# EasyEDA Pro project Signal-blocker_2025-02-25.epro

# Schematic Schematic1

## Sheets
1 Power Supply: Board Name: Board1; Create Date: 2025-02-22; Page Name: Power Supply; Project Name: 振荡器; Schematic Name: Schematic1; Update Date: 2025-02-24; Company: 嘉立创EDA; Page Size: A4; Version: V1.0
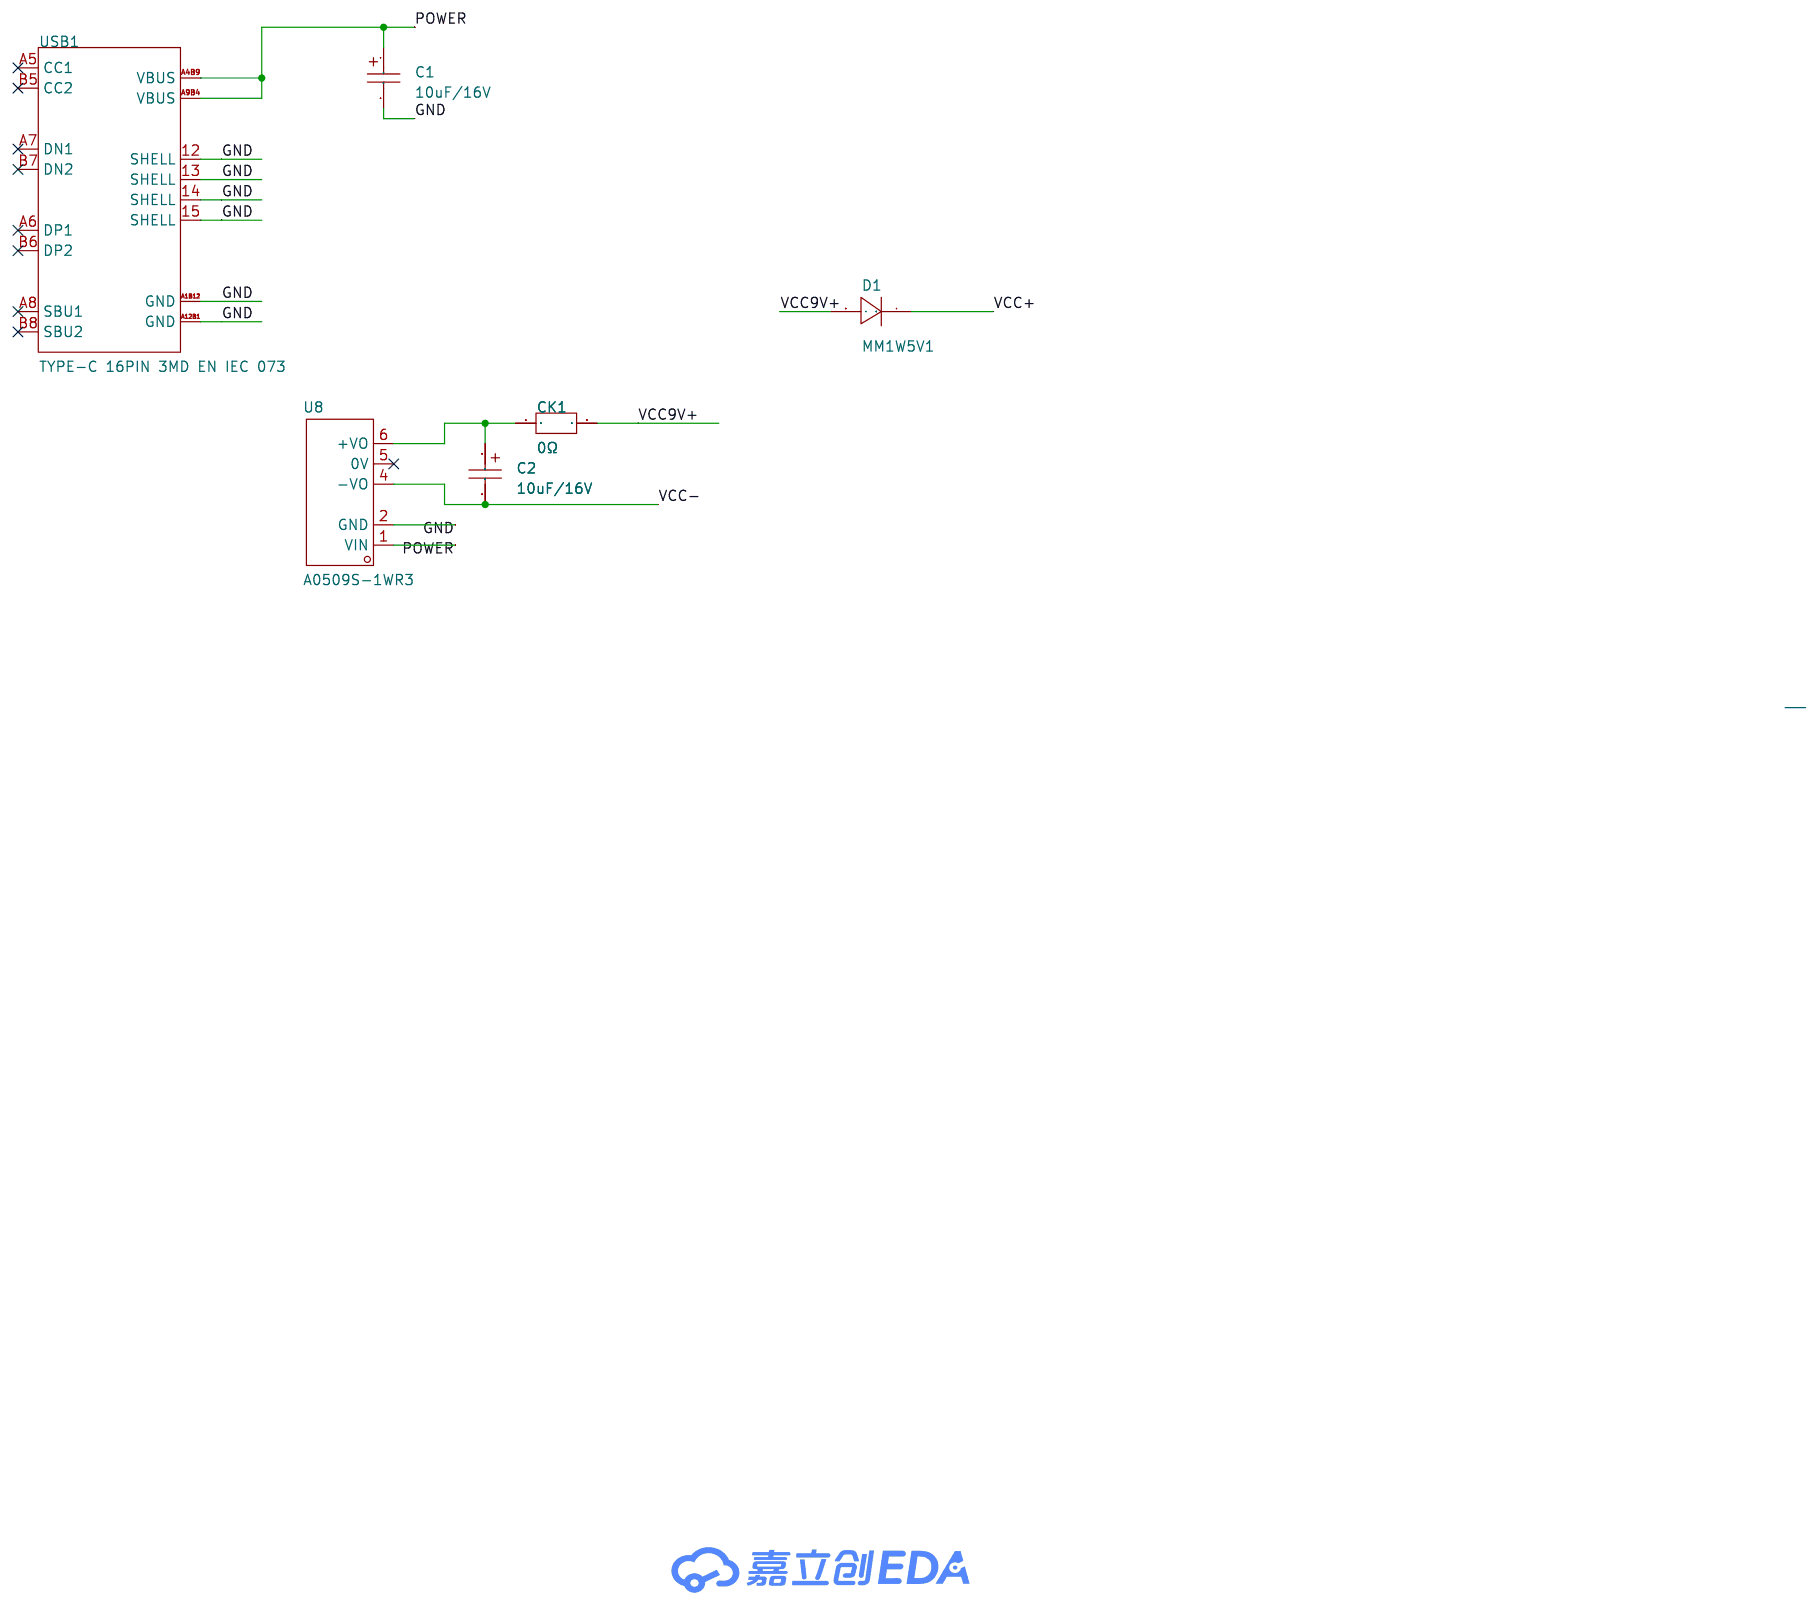
[diagram p0: Power Supply]
2 VCO Module: Create Date: 2025-02-24; Page Name: VCO Module
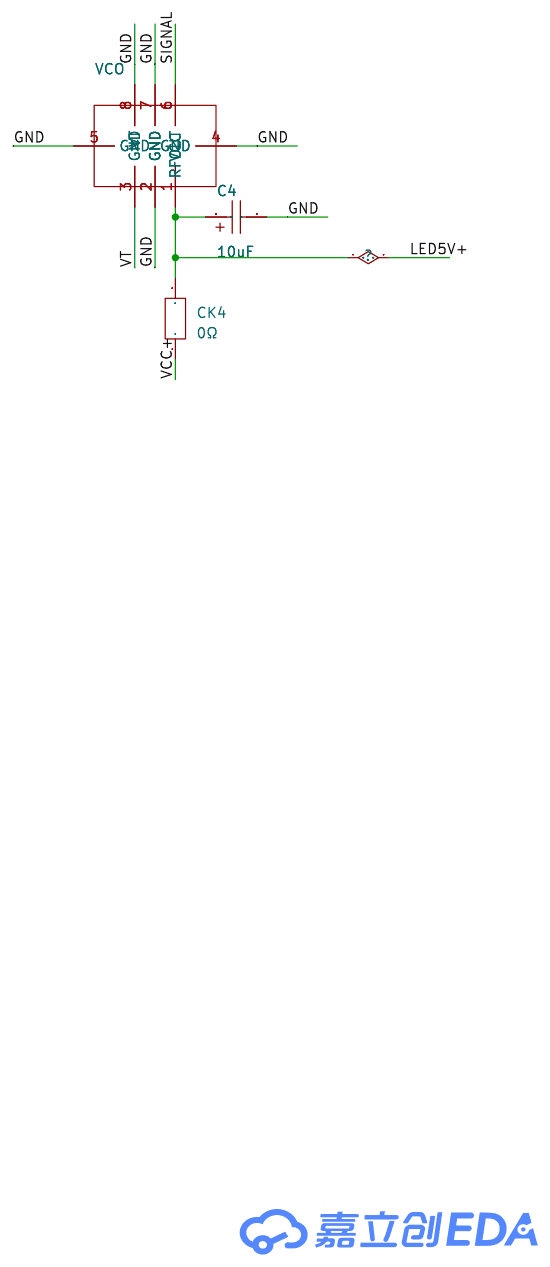
[diagram p1: VCO Module]
3 RFID Module: Create Date: 2025-02-24; Page Name: RFID Module
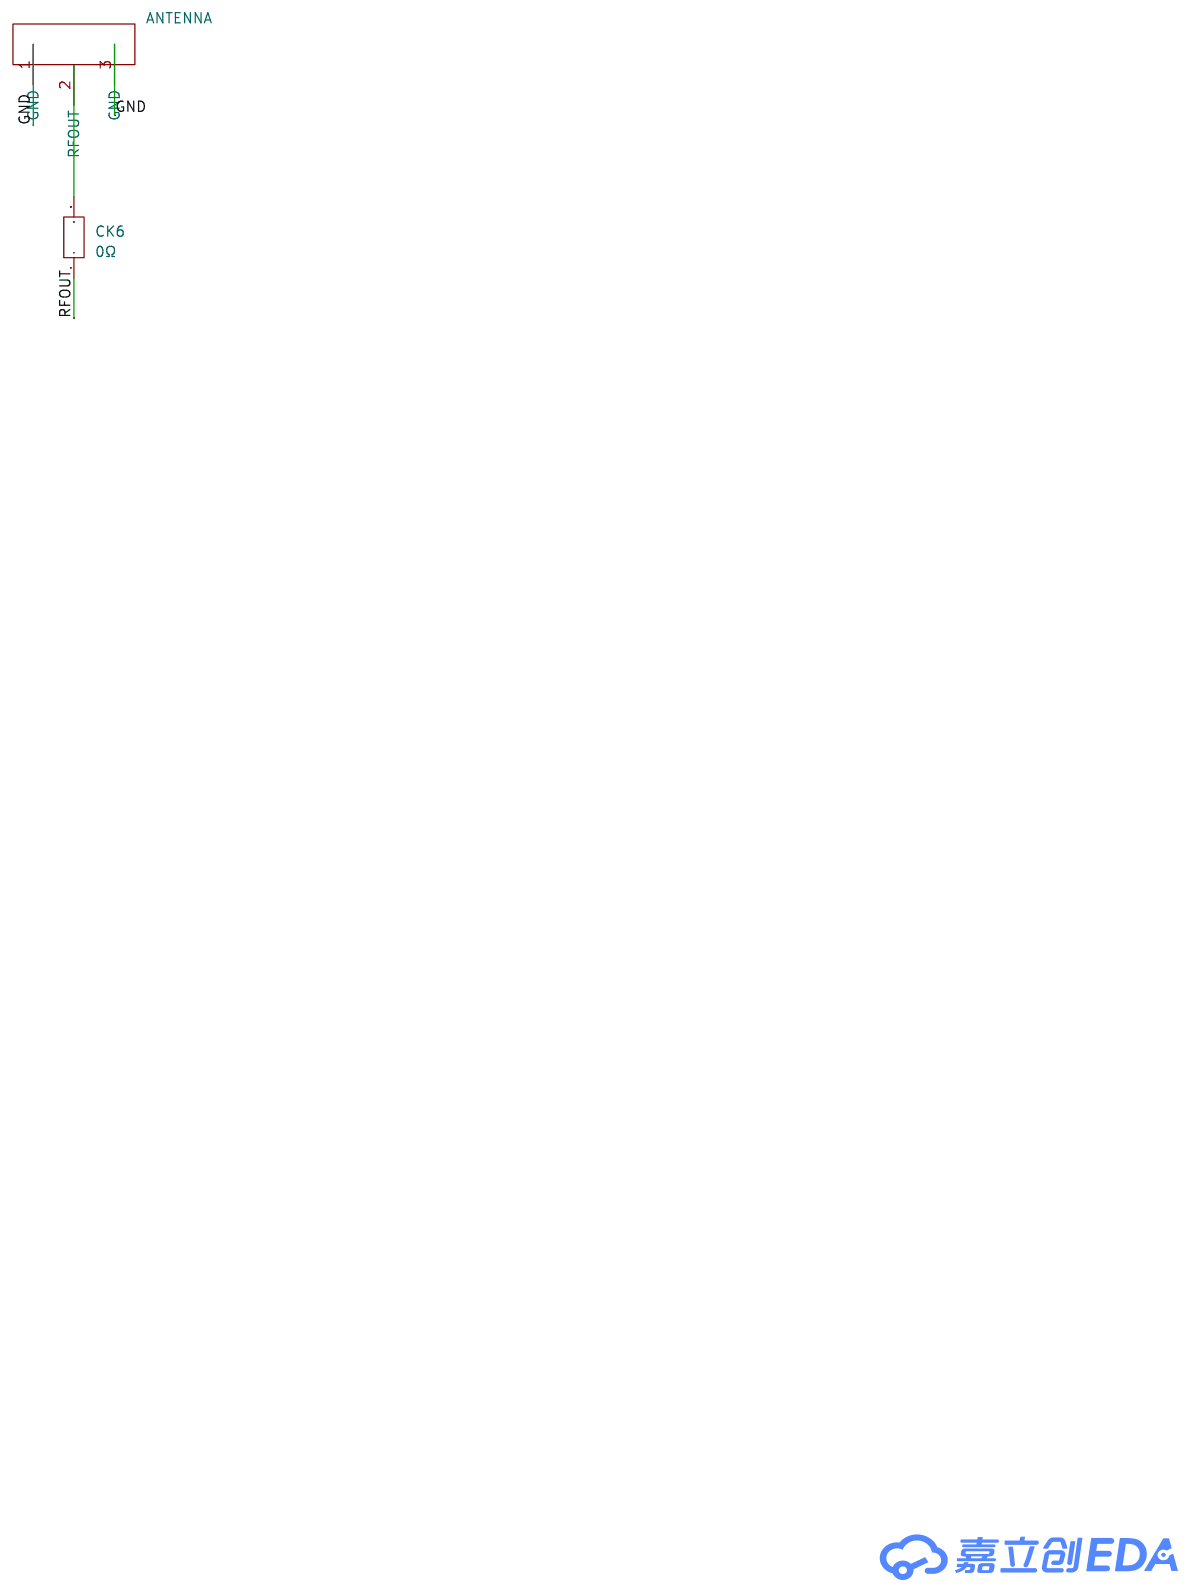
[diagram p2: RFID Module]
4 Voltage-adjust Module: Create Date: 2025-02-24; Page Name: Voltage-adjust Module
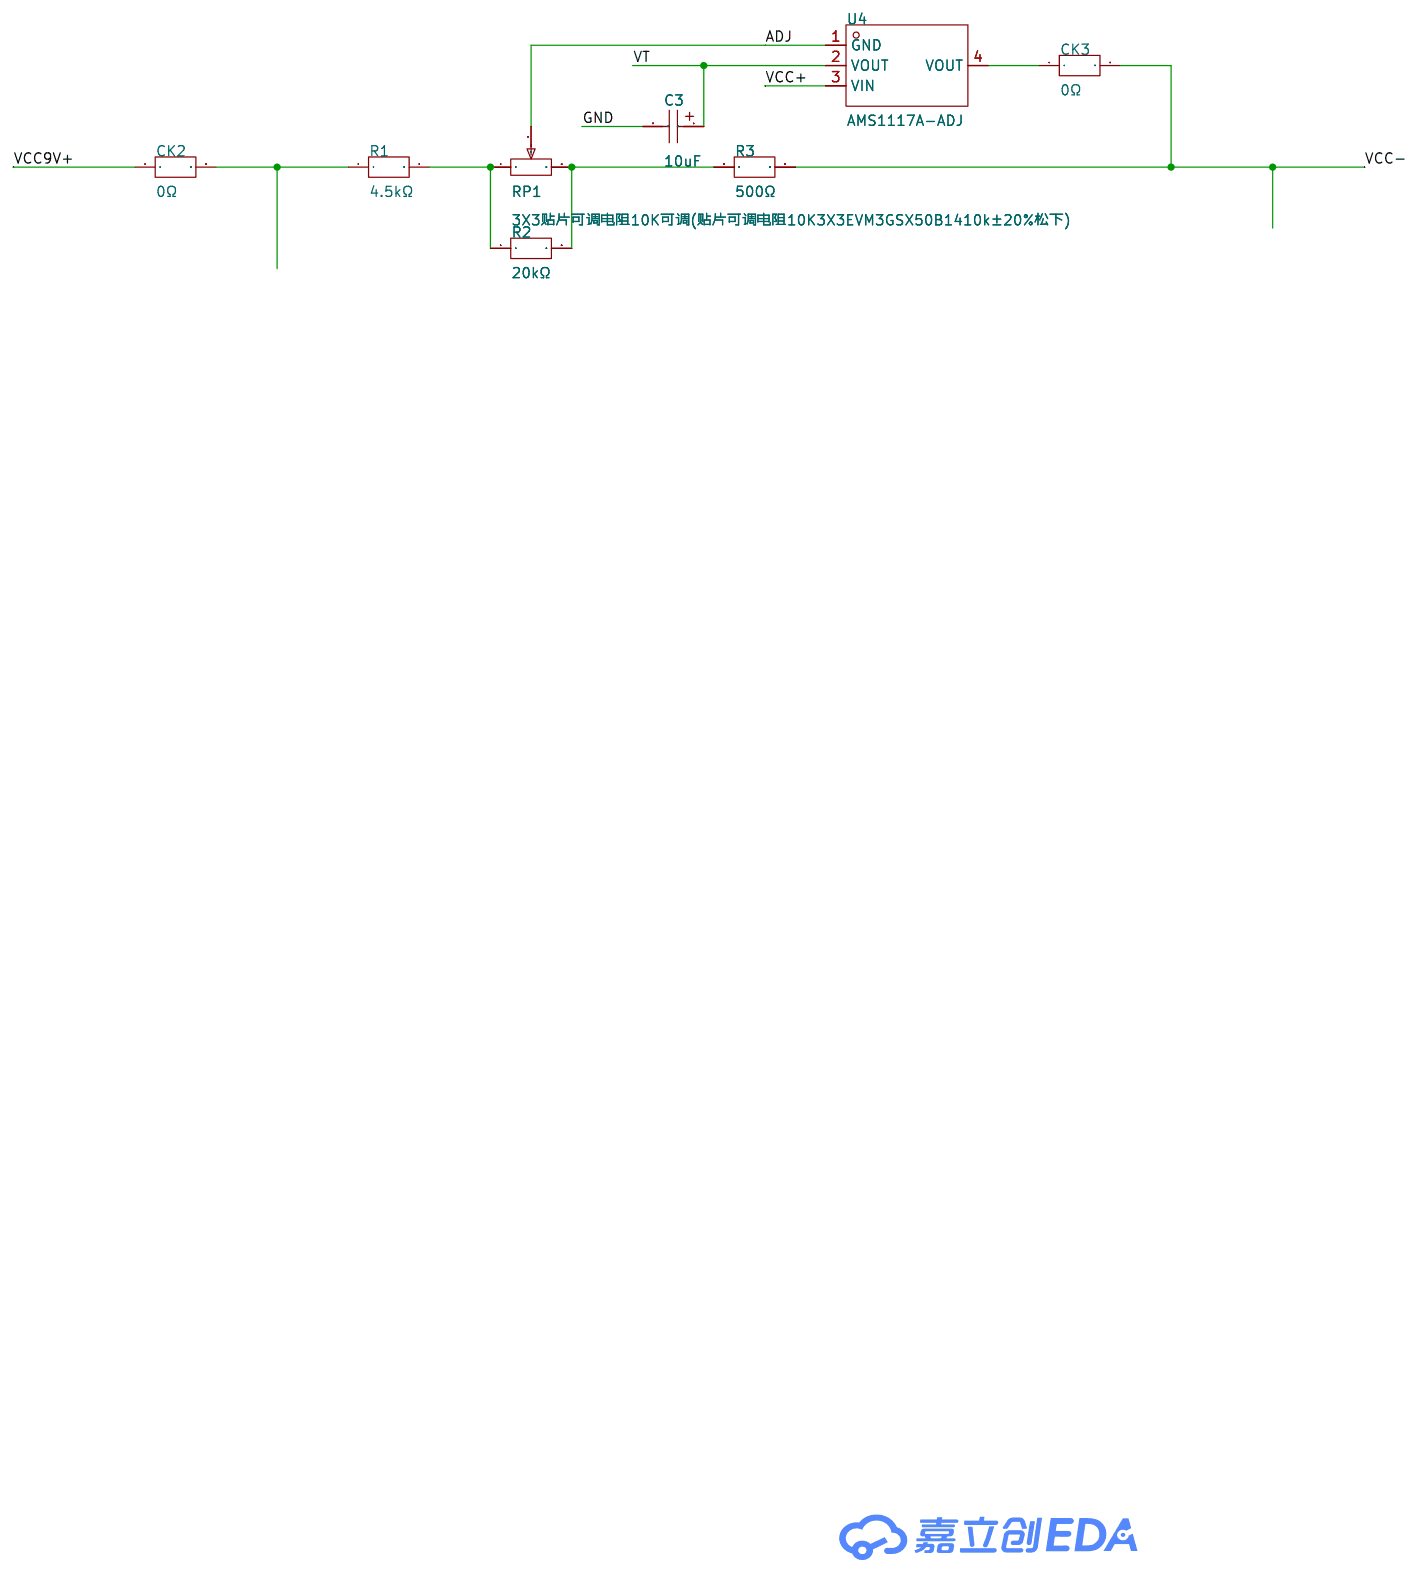
[diagram p3: Voltage-adjust Module]
5 Check Circuit: Create Date: 2025-02-24; Page Name: Check Circuit
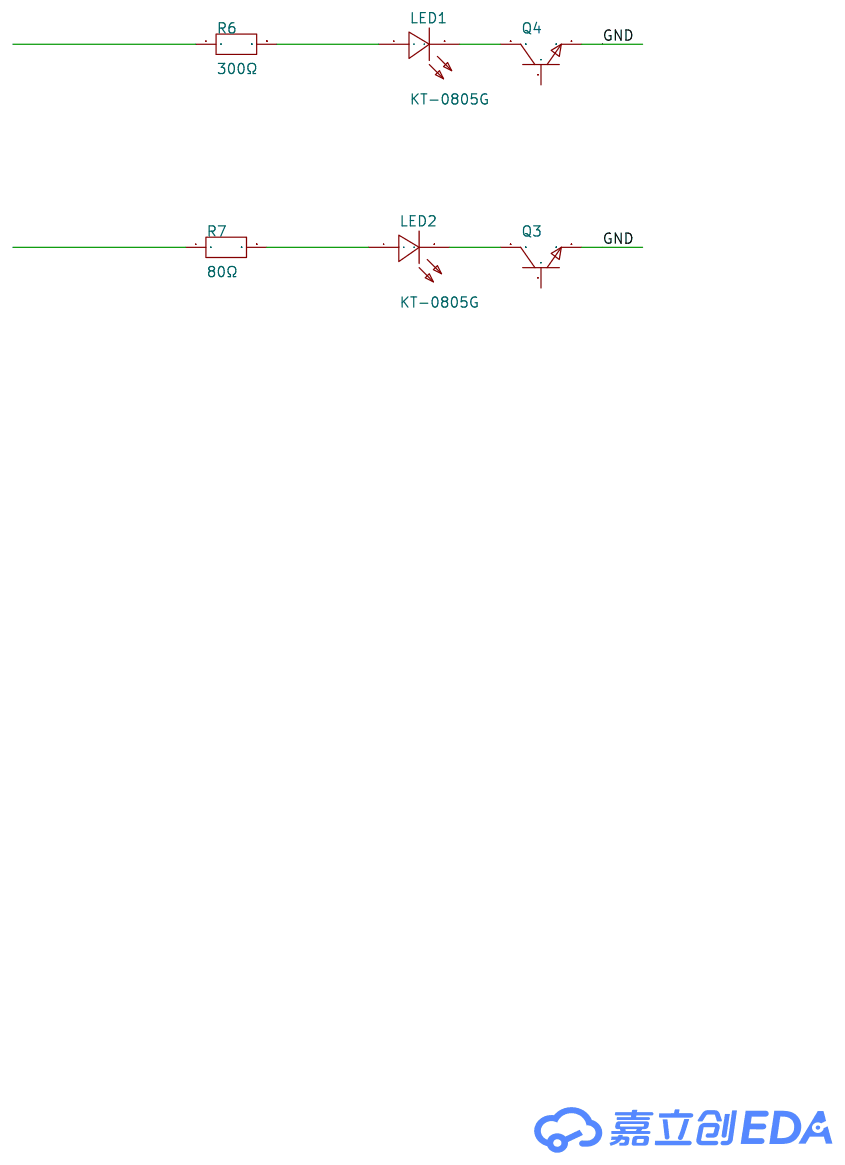
[diagram p4: Check Circuit]
6 Noise-remove Module: Create Date: 2025-02-24; Page Name: Noise-remove Module
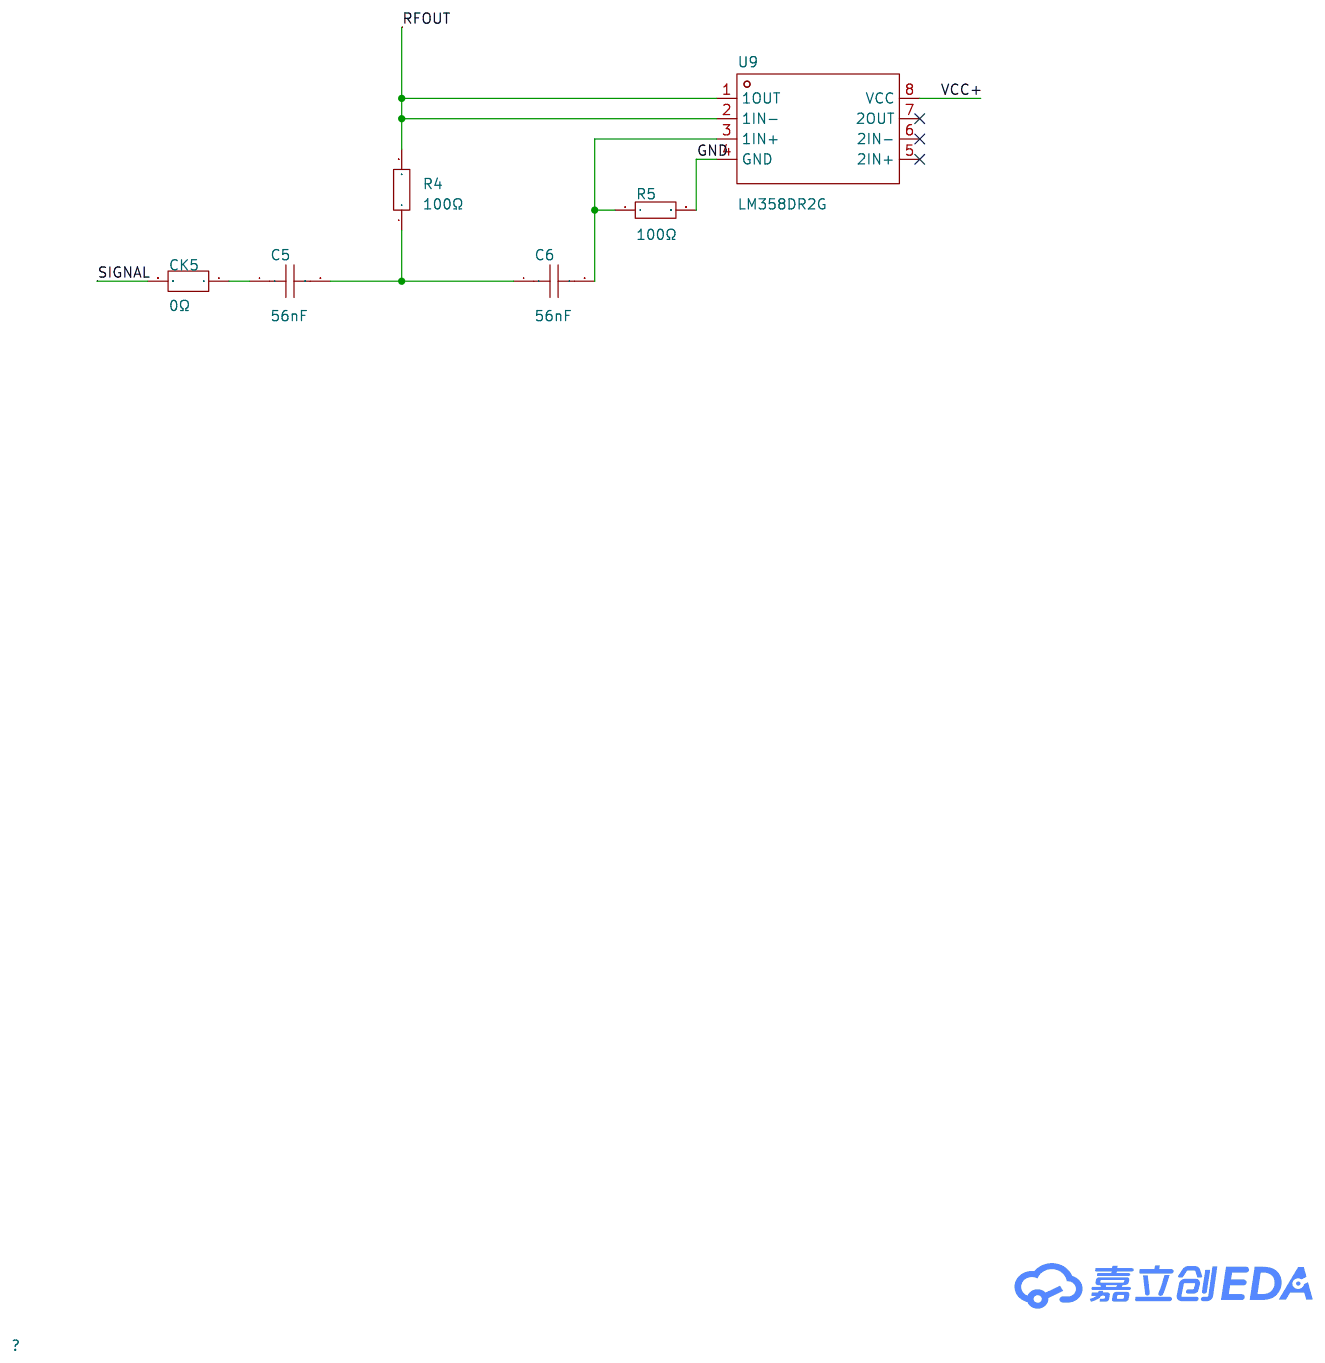
[diagram p5: Noise-remove Module]
7 Signal-enhance Module: Create Date: 2025-02-24
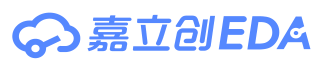
[diagram p6: Signal-enhance Module]

## Parts
sheet Check Circuit
LED1  KT-0805G  [LED0805-R-RD]
LED2  KT-0805G  [LED0805-R-RD]
Q3  -  [S8050_SOT-23]
Q4  -  [S8050_SOT-23]
R6  300Ω  [R2010]
R7  80Ω  [R2010]
sheet Noise-remove Module
C5  56nF  [C0402]
C6  56nF  [C0402]
CK5  0Ω  [R0603]
R4  100Ω  [R0805]
R5  100Ω  [R0805]
U9  LM358DR2G  [SOIC-8_L5.0-W4.0-P1.27-LS6.0-BL]
sheet Power Supply
C1  10uF/16V  [CAP-SMD_L3.2-W1.6-RD-C7171]
C2  10uF/16V  [CAP-SMD_L3.2-W1.6-RD-C7171]
CK1  0Ω  [R0603]
D1  MM1W5V1  [SOD-123_L2.7-W1.6-LS3.7-RD]
U8  A0509S-1WR3  [PWRM-TH_A05XXS-1WR3]
USB1  TYPE-C 16PIN 3MD EN IEC 073  [TYPE-C-SMD_HDGC_TYPE-C-ZL-104PWB]
sheet RFID Module
ANTENNA  -  [wire]
CK6  0Ω  [R0603]
sheet VCO Module
C4  10uF  [CAP-SMD_L3.2-W1.6-RD-C7171]
CK4  0Ω  [R0603]
VCO  -  [1234]
sheet Voltage-adjust Module
C3  10uF  [CAP-SMD_L3.2-W1.6-RD-C7171]
CK2  0Ω  [R0603]
CK3  0Ω  [R0603]
R1  4.5kΩ  [R0805]
R2  20kΩ  [R0805]
R3  500Ω  [R0805]
RP1  3X3贴片可调电阻10K可调(贴片可调电阻10K3X3EVM3GSX50B1410k±20%松下)  [RES-ADJ-SMD_3P-L3.0-W3.8-P1.75-BR]
U4  AMS1117A-ADJ  [SOT-223_L6.3-W3.5-P2.30-LS7.0-BR]

## Library data of the parts
LED1 LED2 = KT-0805G: 灯头类型:-;发光颜色:翠绿色;正向电压(VF):-;功率:-;正向电流:-;主波长:-;二极管配置:-;透镜颜色:-;色温:-;发光强度:-;发光角度:-;载带方式:-;工作温度:-;; LCSC Part Name: 0805 翠绿 高亮; Supplier Part: C2297; Manufacturer: KENTO; Supplier Footprint: 0805; JLCPCB Part Class: 基础库; Datasheet: https://atta.szlcsc.com/upload/public/pdf/source/20170209/1486607340485.pdf; Supplier: LCSC; Emitted Color: 翠绿色
Q3 Q4 = S8050_SOT_NPN: Supplier Footprint: SOT-23
R6 R7 = RS-10K3001FT: 电阻类型:厚膜电阻;阻值:3kΩ;精度:±1%;功率:750mW;温度系数:±100ppm/℃;; LCSC Part Name: 厚膜电阻 3kΩ ±1% 750mW; Supplier Part: C880255; Manufacturer: FH(风华); Supplier Footprint: 2010; JLCPCB Part Class: 扩展库; Datasheet: https://atta.szlcsc.com/upload/public/pdf/source/20140616/1457707091974.pdf; Supplier: LCSC; Type: 厚膜电阻; Tolerance: ±1%; Power(Watts): 750mW; Temperature Coefficient: ±100ppm/℃
C5 C6 = 0402B563K160CT: 容值:56nF;精度:±10%;额定电压:16V;材质(温度系数):X7R;; LCSC Part Name: 56nF ±10% 16V; Supplier Part: C555392; Manufacturer: Walsin(华新科); Supplier Footprint: 0402; JLCPCB Part Class: 扩展库; Datasheet: https://atta.szlcsc.com/upload/public/pdf/source/20191217/C469650_84AD5C6F618CF4AC0C6D987F2E8FE6F8.pdf; Supplier: LCSC; Tolerance: ±10%; Voltage Rated: 16V; Temperature Coefficient: X7R
CK1-CK6 = 0Ω: Supplier Part: C9900083234; Supplier Footprint: 0603; JLCPCB Part Class: 扩展库; Supplier: LCSC
R4 R5 = 0805W8F1000T5E: 电阻类型:厚膜电阻;阻值:100Ω;精度:±1%;功率:125mW;最大工作电压:150V;温度系数:±100ppm/℃;; LCSC Part Name: 100Ω ±1% 125mW 厚膜电阻; Supplier Part: C17408; Manufacturer: UNI-ROYAL(厚声); Supplier Footprint: 0805; JLCPCB Part Class: 基础库; Datasheet: https://atta.szlcsc.com/upload/public/pdf/source/20200306/C422600_1E6D84923E4A46A82E41ADD87F860B5C.pdf; Supplier: LCSC; Type: 厚膜电阻; Tolerance: ±1%; Power(Watts): 125mW; Overload Voltage (Max): 150V; Temperature Coefficient: ±100ppm/℃; Operating Temperature Range: -55℃~+155℃
U9 = LM358DR2G: 放大器数:双路;轨到轨:-;增益带宽积(GBP):1MHz;输入失调电压(Vos):7mV;压摆率(SR):-;输入偏置电流(Ib):45nA;; Supplier Part: C7950; Manufacturer: onsemi(安森美); Supplier Footprint: SOIC-8; JLCPCB Part Class: 基础库; Datasheet: https://atta.szlcsc.com/upload/public/pdf/source/20150124/1457707258826.pdf; Supplier: LCSC; Number of Circuits: 双路; Maximum Power Supply Range (Vdd-Vss): 32V; Gain Bandwidth Product(GBP): 1MHz; Voltage - Input Offset(Vos): 7mV; Input Offset Voltage Drift (Vos TC): 7uV/℃; Current - Input Bias(Ib): 45nA; Common Mode Rejection Ratio (CMRR): 70dB; Quiescent Current: 1.5mA; Output Current: 40mA; Operating Temperature: 0℃~+70℃
C1-C4 = TAJA106K016RNJ: 容值:10uF;精度:±10%;额定电压:16V;等效串联电阻:3Ω@100kHz;; LCSC Part Name: 10uF ±10% 16V; Supplier Part: C7171; Manufacturer: Kyocera AVX; Supplier Footprint: CASE-A-3216; JLCPCB Part Class: 基础库; Datasheet: https://atta.szlcsc.com/upload/public/pdf/source/20160107/1457707750344.pdf; Supplier: LCSC; Tolerance: ±10%; Rated Voltage: 16V; Equivalent Series Resistance(ESR): 3Ω@100kHz; Operating Temperature: -55℃~+125℃
D1 = MM1W5V1: 二极管配置:独立式;稳压值(标称值):5.1V;稳压值(范围):4.84V~5.36V;功率(Pd):1W;; LCSC Part Name: 齐纳二极管 5.1V 1W; Supplier Part: C382836; Manufacturer: 晶导微电子; Supplier Footprint: SOD-123; JLCPCB Part Class: 扩展库; Datasheet: https://atta.szlcsc.com/upload/public/pdf/source/20190618/C382951_749579DA53C45F90F6E07B432E1D8FD6.pdf; Supplier: LCSC; Diode Configuration: 独立式; Zener Voltage (Nom): 5.1V; Reverse Leakage Current (Ir): 10uA@1V; Zener Voltage (Range): 4.84V~5.36V; Power Dissipation: 1W; Zener Impedance (Zzt): 7Ω
U8 = A0509S-1WR3_C5369385: A0509S-1WR3 ---是小体积，高效率的微小功率，定电压输入，隔离非稳压正负双路输出，DC/DC 模块电源；该产品是专门针对板上电源系统中需要产生一组与输入电源隔离的电压的应用场合而设计的。该产品适用于：●输入电源的电压比较稳定（电压变化范围±10%Vin）；●输入输出之间要求隔离（隔离电压≤1500VDC）；●对输出电压稳定度要求不高的场合。；●典型应用：纯数字电路场合，一般低频模拟电路场合，继电器驱动电路，数据交换电路场合等;; Supplier Part: C5369385; Manufacturer: YLPTEC(易川); Supplier Footprint: SIP; JLCPCB Part Class: 扩展库; Datasheet: https://atta.szlcsc.com/upload/public/pdf/source/20230712/CE7059F6A87E500D281D8B0F754C5B41.pdf; Supplier: LCSC; TYPE: 升压型; Number of channel: 2; Power: 1W; input voltage (Vdc): 4.5V~5.5V; Conversion Efficiency: 89%; Output Voltage: ±9V; Output Current (Max): ±56mA；±6mA; Maximum Capacitive Load: 560uF; Insulated Voltage: 1500V; Protective function: 短路保护
USB1 = TYPE-C 16PIN 3MD EN IEC 073: TYPE C 16PIN母座 带弹 5A 符合最新欧盟lEC62680-1-3认证; LCSC Part Name: TYPE-C 母座; Supplier Part: C42434192; Manufacturer: SHOU HAN(首韩); Supplier Footprint: SMD; Datasheet: https://atta.szlcsc.com/upload/public/pdf/source/20250103/7C8E9EC35CBB36C3A211B1F25C96EB7A.pdf; Supplier: LCSC
ANTENNA = wire
VCO = vco
R1 = Y16294K50000B9W: 电阻类型:-;阻值:4.5kΩ;精度:±0.1%;功率:100mW;温度系数:±0.2ppm/℃;; LCSC Part Name: 4.5kΩ ±0.1% 100mW; Supplier Part: C4226006; Manufacturer: VISHAY(威世); Supplier Footprint: 0805; JLCPCB Part Class: 扩展库; Supplier: LCSC; Tolerance: ±0.1%; Power(Watts): 100mW; Temperature Coefficient: ±0.2ppm/℃; Operating Temperature Range: -55℃~+150℃
R2 = RT0805BRD0753R6L: 电阻类型:薄膜电阻;阻值:53.6Ω;精度:±0.1%;功率:125mW;温度系数:±25ppm/℃;; LCSC Part Name: 薄膜电阻 53.6Ω ±0.1% 125mW; Supplier Part: C865552; Manufacturer: YAGEO(国巨); Supplier Footprint: 0805; JLCPCB Part Class: 扩展库; Datasheet: https://atta.szlcsc.com/upload/public/pdf/source/20200610/C326738_5639A9F1B6EB6E4AE2197577D3456E7F.pdf; Supplier: LCSC; Type: 薄膜电阻; Tolerance: ±0.1%; Power(Watts): 125mW; Temperature Coefficient: ±25ppm/℃; Operating Temperature: -55℃~+155℃
R3 = AR05ATB0500: 阻值:50Ω;精度:±0.05%;温度系数:±10ppm/℃;; LCSC Part Name: 50Ω ±0.05%; Supplier Part: C3015189; Manufacturer: Viking(光颉); Supplier Footprint: 0805; JLCPCB Part Class: 扩展库; Datasheet: https://atta.szlcsc.com/upload/public/pdf/source/20191129/C465721_10D49275DB41E427863CE9C8D788770A.pdf; Supplier: LCSC; Tolerance: ±0.05%; Temperature Coefficient: ±10ppm/℃
RP1 = 3X3贴片可调电阻10K可调(贴片可调电阻10K3X3EVM3GSX50B1410k±20%松下): Supplier Part: C9900002171; Supplier Footprint: SMD-3; JLCPCB Part Class: 扩展库; Supplier: LCSC
U4 = AMS1117A-ADJ: Supplier Part: C2984864; Manufacturer: HX(恒佳兴); Supplier Footprint: SOT-223; JLCPCB Part Class: 扩展库; Datasheet: https://atta.szlcsc.com/upload/public/pdf/source/20220408/BD3226BAC8A4B812F5CB2AD559ECEC03.pdf; Supplier: LCSC

## Nets
GND: ANTENNA.1(GND) ANTENNA.3(GND) C1.2 C3.2 C4.2 Q3.2 Q4.2 R5.2 U8.2(GND) U9.4(GND) USB1.12(SHELL) USB1.13(SHELL) USB1.14(SHELL) USB1.15(SHELL) USB1.A1B12(GND) USB1.A12B1(GND) VCO.2(GND) VCO.4(GND) VCO.5(GND) VCO.7(GND) VCO.8(VT)
VCC9V+: CK1.2 CK2.1 D1.2(A)
VCC+: CK4.1 D1.1(C) U4.3(VIN) U9.8(VCC)
VCC-: C2.2 CK3.2 R3.2 U8.4(-VO)
ADJ: RP1.2 U4.1(GND)
LED5V+: C4.1 CK4.2 VCO.1(VCC)
POWER: C1.1 U8.1(VIN) USB1.A4B9(VBUS) USB1.A9B4(VBUS)
RFOUT: CK6.1 R4.2 U9.1(1OUT) U9.2(1IN-)
SIGNAL: CK5.2 VCO.6(RFOUT)
VT: C3.1 U4.2(VOUT) VCO.3(GND)
$3N135: ANTENNA.2(RFOUT) CK6.2
$4N526: R1.2 R2.1 RP1.1
$4N812: CK3.1 U4.4(VOUT)
$6N289: C5.2 C6.1 R4.1
$6N421: C6.2 R5.1 U9.3(1IN+)
Net-(C2-1): C2.1 CK1.1 U8.6(+VO)
Net-(C5-1): C5.1 CK5.1
Net-(CK2-2): CK2.2 R1.1
Net-(LED1-1): LED1.1(A) R6.2
Net-(LED1-2): LED1.2(K) Q4.3
Net-(LED2-1): LED2.1(A) R7.2
Net-(LED2-2): LED2.2(K) Q3.3
Net-(R2-2): R2.2 R3.1 RP1.3

Not connected (* = marked no-connect by the designer): Q3 1; Q4 1; R6 1; R7 1; U8 5(0V)*; U9 5(2IN+)* 6(2IN-)* 7(2OUT)*; USB1 A5(CC1)* A6(DP1)* A7(DN1)* A8(SBU1)* B5(CC2)* B6(DP2)* B7(DN2)* B8(SBU2)*

# Board PCB1
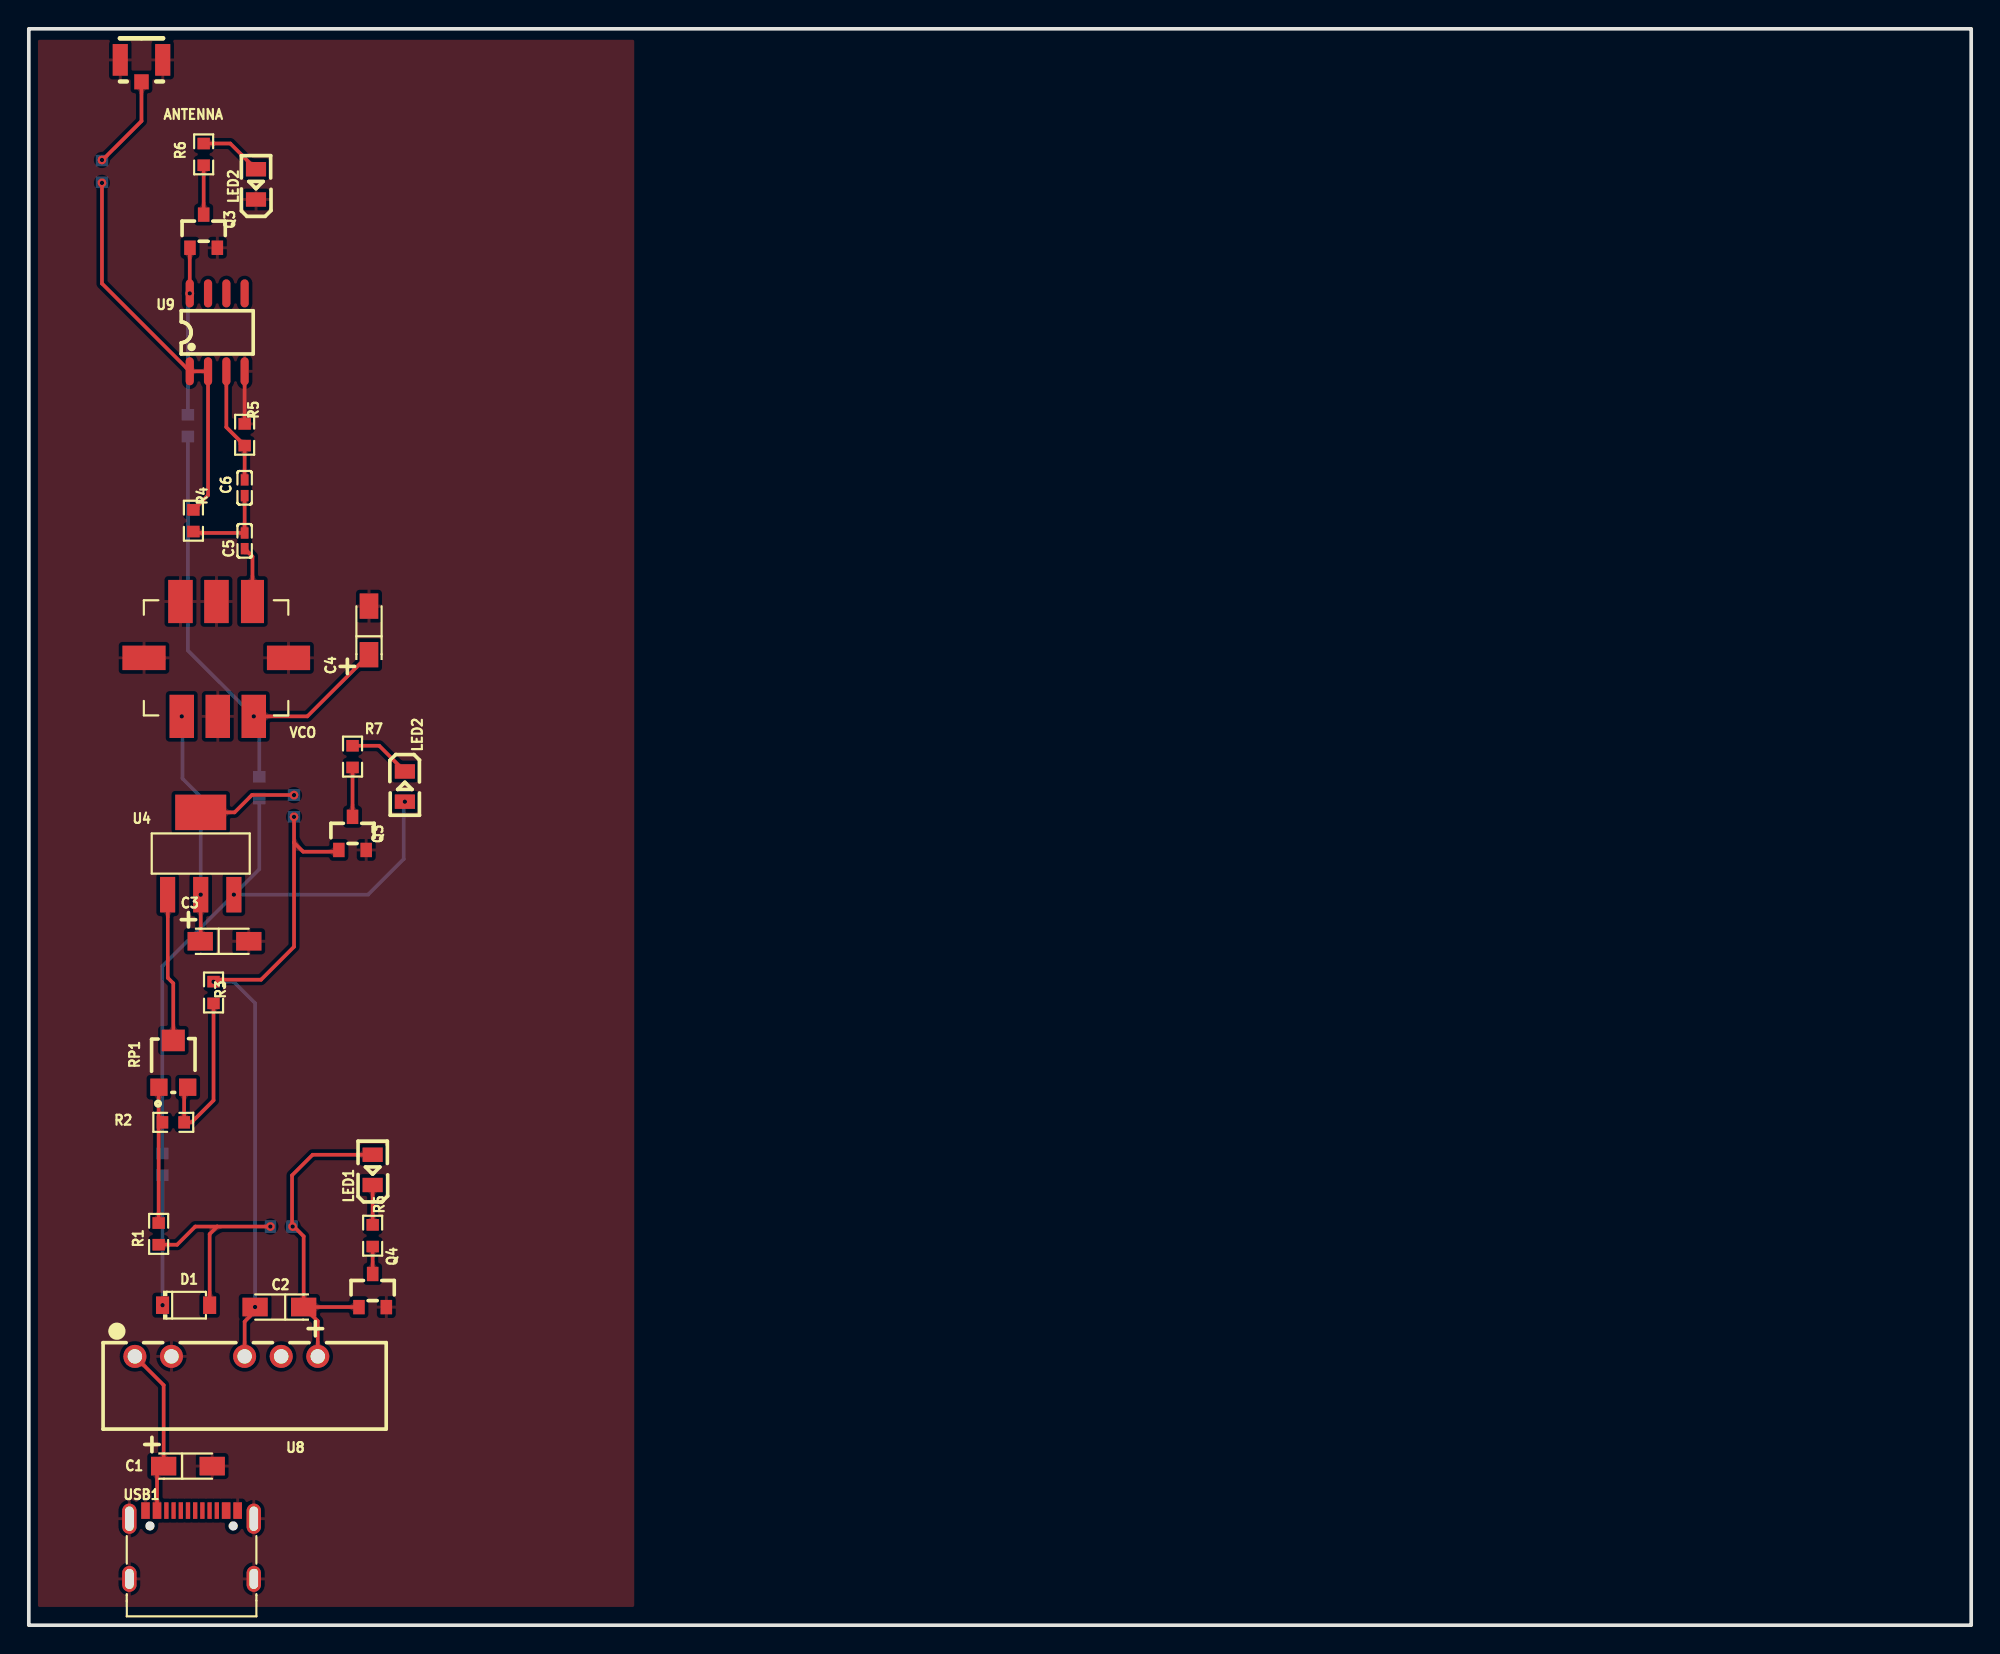
[diagram p7: board, top side]
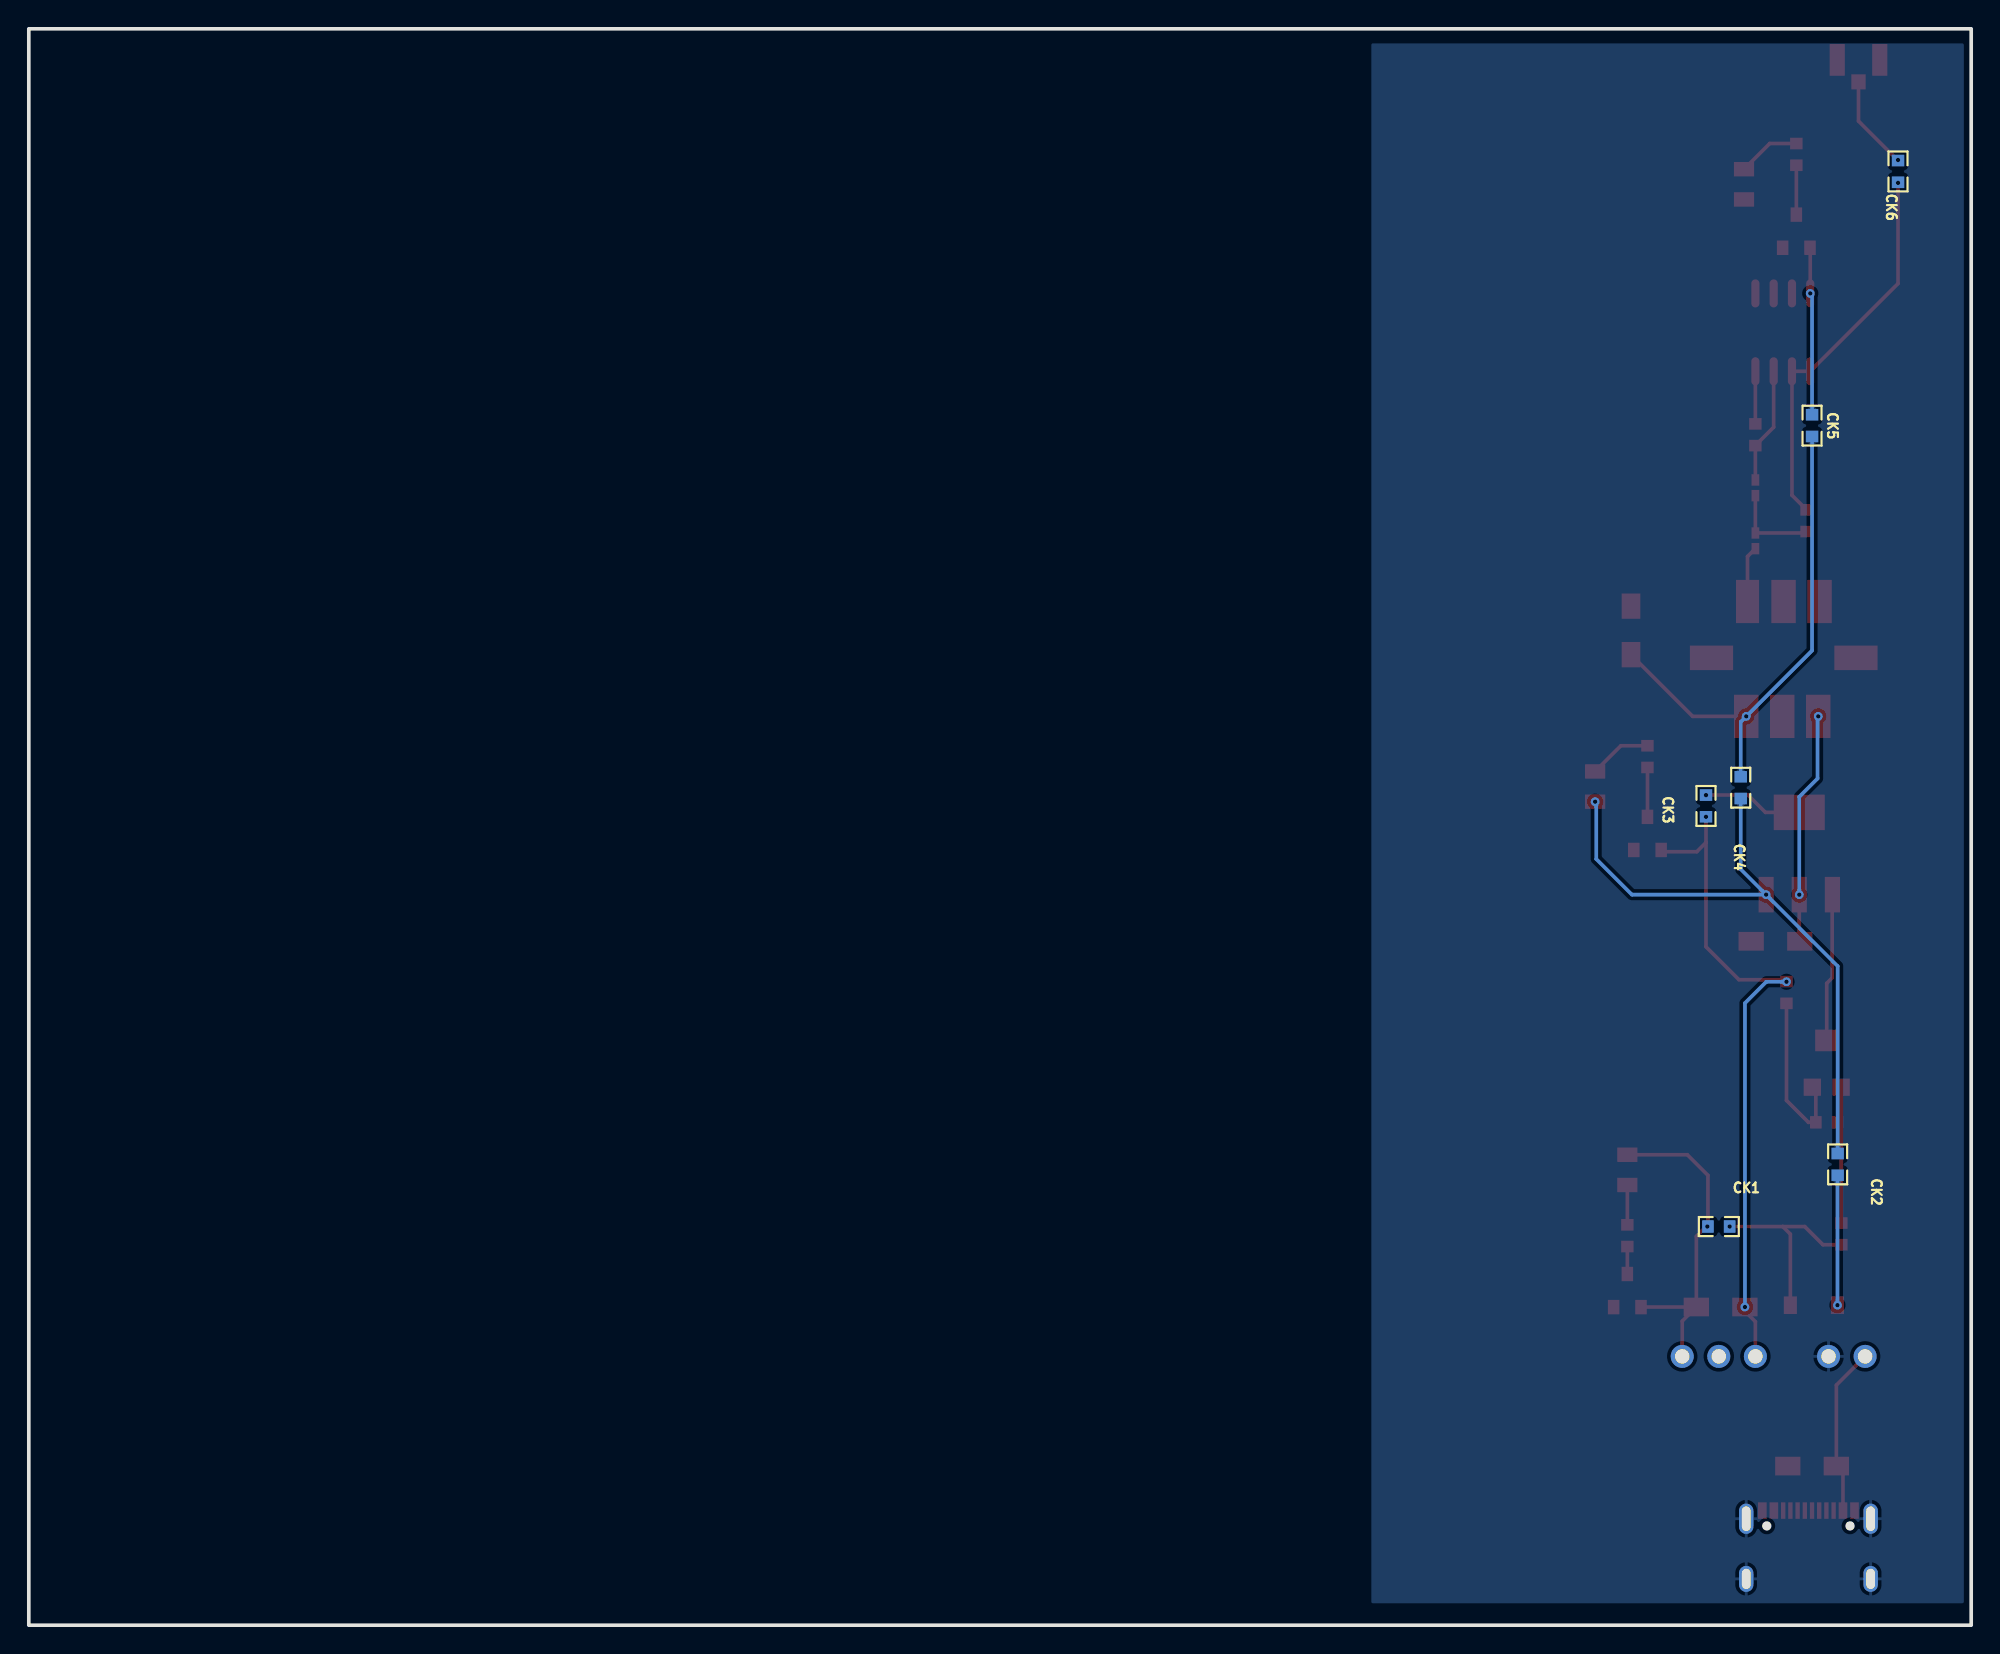
[diagram p8: board, bottom side, seen from below]

Outline 134.87 x 110.87 mm; copper layers: Top Layer, Bottom Layer. Coordinates in mm from the lower left corner of the outline.
Outline path: rectangle 0,110.87 134.87,0
Stack: Top Layer 0.035mm / Dielectric1 1.51mm FR4 er 4.5 / Bottom Layer 0.035mm

## Design rules (mm)
template: JLCPCB Capability(Two Layers Board)
spacing copperThickness1oz (default): track to track 0.102, other pairs 0.152 to 0.3
spacing copperThickness2oz: track to track 0.203, other pairs 0.152 to 0.3
track width copperThickness1oz (default): min 0.127, default 0.254, max 2.54
track width copperThickness2oz: min 0.203, default 0.254, max 2.54
differential pair differentialPair (default): width min 0.127, default 0.254, max 2.54; gap min 0.152, default 0.152
via viaSize (default): diameter min 0.5, default 0.61, max 10; hole min 0.3, default 0.305, max 6.3

## Placement (name value [footprint] x y rotation side)
ANTENNA  -  [wire]  5.72 110.49 0 top
C1  10uF/16V  [CAP-SMD_L3.2-W1.6-RD-C7171]  11.05 11.05 0 top
C2  10uF/16V  [CAP-SMD_L3.2-W1.6-RD-C7171]  17.4 22.1 180 top
C3  10uF  [CAP-SMD_L3.2-W1.6-RD-C7171]  13.59 47.5 0 top
C4  10uF  [CAP-SMD_L3.2-W1.6-RD-C7171]  23.62 69.09 90 top
C5  56nF  [C0402]  14.99 75.31 90 top
C6  56nF  [C0402]  14.99 78.99 90 top
CK1  0Ω  [R0603]  17.53 27.69 180 bottom
CK2  0Ω  [R0603]  9.27 32 270 bottom
CK3  0Ω  [R0603]  18.42 56.9 270 bottom
CK4  0Ω  [R0603]  16 58.17 90 bottom
CK5  0Ω  [R0603]  11.05 83.31 90 bottom
CK6  0Ω  [R0603]  5.08 100.97 90 bottom
D1  MM1W5V1  [SOD-123_L2.7-W1.6-LS3.7-RD]  10.92 22.22 0 top
LED1  KT-0805G  [LED0805-R-RD]  23.88 31.62 90 top
LED2  KT-0805G  [LED0805-R-RD]  26.11 58.24 270 top
LED2#2  -  [LED0805-R-RD]  15.78 100.07 90 top
Q3  -  [S8050_SOT-23]  22.35 54.99 270 top
Q3#2  -  [S8050_SOT-23]  12.02 96.82 270 top
Q4  -  [S8050_SOT-23]  23.75 23.24 270 top
R1  4.5kΩ  [R0603]  9.02 27.18 90 top
R2  20kΩ  [R0603]  10.03 34.92 0 top
R3  500Ω  [R0603]  12.83 43.94 270 top
R4  100Ω  [R0603]  11.43 76.71 90 top
R5  100Ω  [R0603]  14.99 82.68 90 top
R6  300Ω  [R0603]  12.14 102.15 270 top
R6#2  -  [R0603]  23.88 27.05 270 top
R7  80Ω  [R0603]  22.48 60.33 270 top
RP1  3X3贴片可调电阻10K可调(贴片可调电阻10K3X3EVM3GSX50B1410k±20%松下)  [RES-ADJ-SMD_3P-L3.0-W3.8-P1.75-BR]  10.03 38.99 270 top
U4  AMS1117A-ADJ  [SOT-223_L6.3-W3.5-P2.30-LS7.0-BR]  11.94 53.59 270 top
U8  A0509S-1WR3  [PWRM-TH_A05XXS-1WR3]  13.72 18.67 0 top
U9  LM358DR2G  [SOIC-8_L5.0-W4.0-P1.27-LS6.0-BL]  13.08 89.79 0 top
USB1  TYPE-C 16PIN 3MD EN IEC 073  [TYPE-C-SMD_HDGC_TYPE-C-ZL-104PWB]  11.3 5.59 0 top
VCO  -  [1234]  13.59 67.18 180 top

## Footprints (pads in the part's own frame, mm; a bottom-side part is the same pattern mirrored in y, then rotated)
1234
  custom 1.7x3 smd: 1(-2.031,4.064) 2(0.469,4.064) 3(2.969,4.064) 7(0.558,-3.913) 8(3.058,-3.913)
  rect 3x1.7 smd: 4(-4.445,0) 5(5.588,0)
  rect 1.6x3 smd: 6(-1.942,-3.913)
C0402
  rect 0.79x0.54 smd: 1(-0.545,0) 2(0.545,0)
CAP-SMD_L3.2-W1.6-RD-C7171
  rect 1.758x1.296 smd: 1(-1.687,0) 2(1.687,0)
LED0805-R-RD
  rect 1x1.399 smd: 1(1.05,0) 2(-1.05,0)
PWRM-TH_A05XXS-1WR3
  round 1.6 hole 1: 1(-6.35,0) 2(-3.81,0) 4(1.27,0) 5(3.81,0) 6(6.35,0)
R0603
  rect 0.806x0.864 smd: 1(-0.753,0) 2(0.753,0)
RES-ADJ-SMD_3P-L3.0-W3.8-P1.75-BR
  rect 1.2x1.2 smd: 1(1.625,-1) 3(1.625,1)
  rect 1.5x1.6 smd: 2(-1.625,0)
S8050_SOT-23
  rect 1x0.8 smd: 1(1.15,-0.823) 2(1.15,1.077) 3(-1.15,0.127)
SOD-123_L2.7-W1.6-LS3.7-RD
  rect 0.91x1.22 smd: 1(-1.635,0) 2(1.635,0)
SOIC-8_L5.0-W4.0-P1.27-LS6.0-BL
  oval 0.569x1.95 smd: 1(-1.905,-2.705) 2(-0.635,-2.705) 3(0.635,-2.705) 4(1.905,-2.705) 5(1.905,2.705) 6(0.635,2.705) 7(-0.635,2.705) 8(-1.905,2.705)
SOT-223_L6.3-W3.5-P2.30-LS7.0-BR
  rect 2.465x1.05 smd: 1(2.857,-2.3) 2(2.857,0) 3(2.857,2.3)
  rect 2.465x3.54 smd: 4(-2.857,0)
TYPE-C-SMD_HDGC_TYPE-C-ZL-104PWB
  oval 1x2.1 hole 0.6x1.7: 12(-4.32,1.808) 13(4.32,1.808)
  oval 1x1.8 hole 0.6x1.4: 14(-4.32,-2.373) 15(4.32,-2.373)
  rect 0.6x1.15 smd: A1B12(-3.2,2.373) A4B9(-2.4,2.373) A9B4(2.4,2.373) A12B1(3.2,2.373)
  rect 0.3x1.15 smd: A5(-1.25,2.373) A6(-0.25,2.373) A7(0.25,2.373) A8(1.25,2.373) B5(1.75,2.373) B6(0.75,2.373) B7(-0.75,2.373) B8(-1.75,2.373)
wire
  rect 1.05x2.2 smd: 1(0.635,-1.778) 3(3.585,-1.778)
  rect 1x1.05 smd: 2(2.11,-3.303)

## Nets
GND: ANTENNA.1 ANTENNA.3 C1.2 C3.2 C4.2 LED2#2.2 Q3.2 Q3#2.2 Q4.2 R5.2 U8.2 U9.4 USB1.12 USB1.13 USB1.14 USB1.15 USB1.A1B12 USB1.A12B1 VCO.2 VCO.4 VCO.5 VCO.7 VCO.8
VCC9V+: C2.1 CK1.1 CK1.2 D1.2 LED1.1 LED1.2 Q4.1 Q4.3 R1.1 R6#2.1 R6#2.2 U8.6
VCC+: C4.1 CK2.1 CK2.2 CK4.1 CK4.2 CK5.1 CK5.2 D1.1 LED2.1 Q3#2.1 U4.3 U9.8 VCO.1
VCC-: C2.2 CK3.2 Q3.1 R3.1 U8.4
ADJ: RP1.2 U4.1
POWER: C1.1 U8.1 USB1.A4B9 USB1.A9B4
RFOUT: CK6.1 R4.2 U9.1 U9.2
SIGNAL: C5.1 VCO.6
VT: C3.1 U4.2 VCO.3
$3N135: ANTENNA.2 CK6.2
$4N521: R2.2 R3.2 RP1.3
$4N526: R1.2 R2.1 RP1.1
$4N812: CK3.1 U4.4
$5N863: LED2.2 LED2#2.1 Q3.3 Q3#2.3 R6.1 R6.2 R7.1 R7.2
$6N289: C5.2 C6.1 R4.1
$6N421: C6.2 R5.1 U9.3

Pads without a net: U8 5; U9 5 6 7; USB1 A5 A6 A7 A8 B5 B6 B7 B8

## Via types
v1: diameter 0.61, hole 0.305, Top Layer to Bottom Layer, 15 vias

## Routing (per net, layer and track width the routed paths; a pad name or vN(x,y) marks a point on that pad's centre or on a via; arc(x,y) is an arc through that point)
GND: length 3.7
  Top Layer w0.254: U9.4 R5.2
VCC9V+: length 42.1
  Top Layer w0.254: LED1.1 19.71,32.67 18.28,31.24 18.28,27.81 ; 13.08,27.69 12.56,27.16 D1.2 ; 13.08,27.69 v1(16.77,27.69) ; 13.08,27.69 11.56,27.69 10.3,26.42 R1.1 ; 18.28,27.81 CK1.1 ; 18.28,27.81 19.09,27.01 C2.1 ; C2.1 22.92,22.1 Q4.1 ; C2.1 20.07,21.12 U8.6 ; R6#2.2 23.88,24.39 ; LED1.2 R6#2.1
  vias: v1(18.32,27.69)
VCC+: length 100.4
  Top Layer w0.254: v1(11.18,92.49) 11.18,95.65 Q3#2.1 ; C4.1 19.34,63.12 v1(15.62,63.12)
  Bottom Layer w0.254: v1(26.11,57.19) 26.03,57.12 26.03,53.21 23.56,50.74 v1(14.24,50.74) ; CK2.1 9.27,45.77 v1(14.24,50.74) ; v1(9.29,22.22) 9.29,31.23 CK2.2 ; v1(11.18,92.49) 11.05,92.37 CK5.2 ; v1(14.24,50.74) 16,52.5 CK4.1 ; CK5.1 11.05,67.69 v1(15.62,63.12) 16,62.74 CK4.2
VCC-: length 47.4
  Top Layer w0.254: v1(18.42,56.14) 18.42,54.36 ; 18.42,54.36 18.42,47.12 16.13,44.83 12.97,44.83 v1(12.83,44.69) ; 18.42,54.36 19.05,53.72 21.41,53.72 Q3.1 ; U8.4 14.99,21.08 15.71,21.81 v1(15.71,22.1)
  Bottom Layer w0.254: v1(15.71,22.1) 15.71,43.2 14.22,44.69 v1(12.83,44.69)
ADJ: length 10.3
  Top Layer w0.254: RP1.2 10.03,44.58 9.65,44.96 9.65,50.72 U4.1
POWER: length 11.7
  Top Layer w0.254: U8.1 9.36,16.67 C1.1 8.9,10.59 USB1.A4B9
RFOUT: length 27
  Top Layer w0.254: CK6.1 5.08,93.18 U9.1 U9.2 12.45,78.48 R4.2
  vias: v1(5.08,100.17)
SIGNAL: length 3.9
  Top Layer w0.254: C5.1 15.53,74.22 VCO.6
VT: length 16.2
  Top Layer w0.254: v1(11.94,50.74) 11.94,47.53 C3.1
  Bottom Layer w0.254: v1(10.62,63.12) 10.67,63.07 10.67,58.8 11.94,57.53 v1(11.94,50.74)
$3N135: length 6.6
  Top Layer w0.254: ANTENNA.2 7.83,104.46 CK6.2
  vias: v1(5.08,101.76)
$4N521: length 12
  Top Layer w0.254: RP1.3 10.79,37.12 R2.2 11.3,34.92 12.83,36.45 R3.2
$4N526: length 9.4
  Top Layer w0.254: RP1.1 9.02,37.35 R1.2
$4N812: length 7
  Top Layer w0.254: U4.4 14.29,56.45 15.49,57.66 18.41,57.66 v1(18.42,57.65)
$5N863: length 15.6
  Top Layer w0.254: Q3#2.3 R6.2 ; LED2.2 24.33,61.08 R7.1 ; R6.1 13.99,102.9 LED2#2.1 ; Q3.3 R7.2
$6N289: length 6.2
  Top Layer w0.254: C6.1 C5.2 11.53,75.86 R4.1
$6N421: length 8.1
  Top Layer w0.254: U9.3 13.72,83.2 14.99,81.93 C6.2

## Copper pours and planes (outline as drawn; the poured copper is in the pictures)
GND on Top Layer: 0.64,110.11 42.04,110.11 42.04,1.27 0.64,1.27
GND on Bottom Layer: 0.51,109.85 41.66,109.85 41.66,1.52 0.51,1.52

Small or netless copper shapes (teardrops, artwork), in the pictures only: 76 on Top Layer, 18 on Bottom Layer
